# Altium schematic sheet KickerManager.SchDoc: Gestion du kicker
size A4; DocumentNumber: 1; Revision: Simon Bouchard; SheetNumber: 1; SheetTotal: 4; Version: Gamma 1.0; Conceptor: Philippe T. Simon B. Léonard G. Alexia B-L.
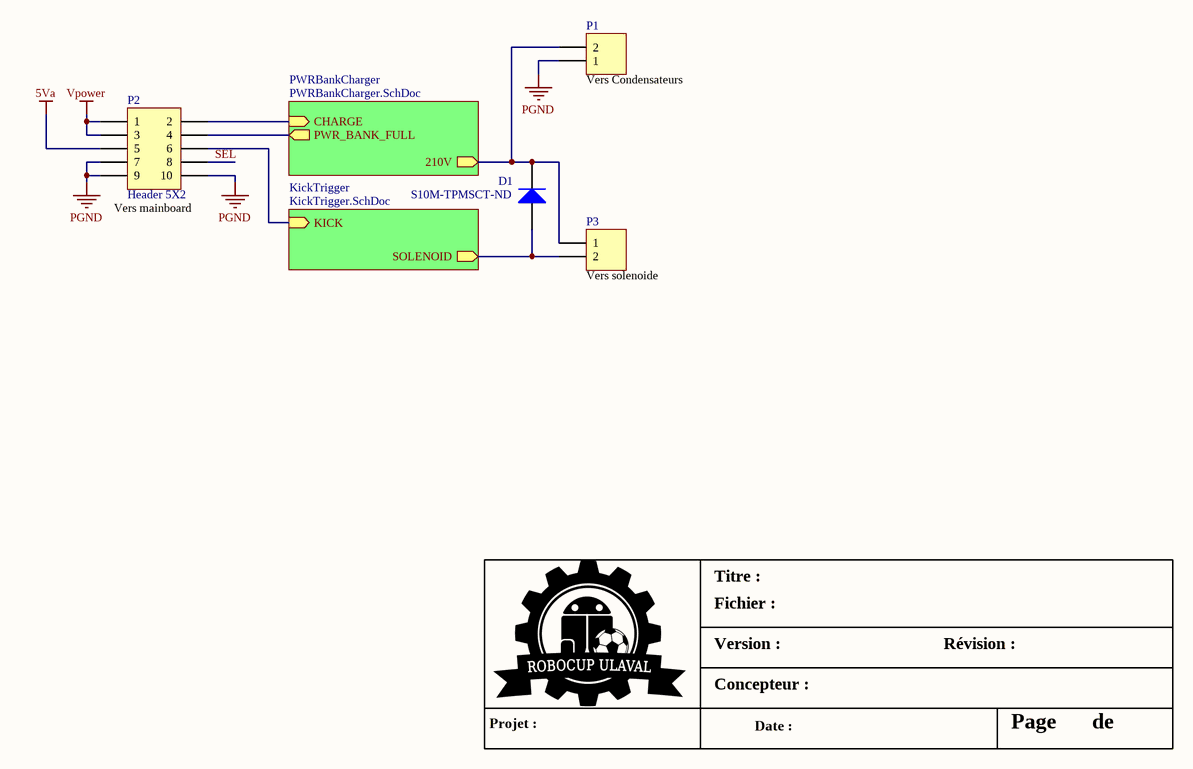
[diagram p0: KickerManager.SchDoc]

## Parts
D1  Supplier Part Number 1: S10M-TPMSCT-ND  [HSMC]  (hidden comment: S10M-TP)
P1  Header 2  [0.156mil 2pin header]  (value not drawn)
P2  Header 5X2  [HDR2X5]
P3  Header 2  [0.156mil 2pin header]  (value not drawn)

## Sub-sheets
KickTrigger = KickTrigger.SchDoc: KICK (in), SOLENOID (out)
PWRBankCharger = PWRBankCharger.SchDoc: CHARGE (in), PWR_BANK_FULL (out), 210V (out)

## Nets
5Va: P2.5
PGND: P1.1 P2.7 P2.9 P2.10
Vpower: P2.1 P2.3
SEL: P2.8
NetD1_A: D1.A P3.2 ; sheet KickTrigger/SOLENOID
NetD1_K: D1.K P1.2 P3.1 ; sheet PWRBankCharger/210V
NetP2_2: P2.2 ; sheet PWRBankCharger/CHARGE
NetP2_4: P2.4 ; sheet PWRBankCharger/PWR_BANK_FULL
NetP2_6: P2.6 ; sheet KickTrigger/KICK

## Notes on the sheet
- (near P1) Vers Condensateurs
- (near P2) Vers mainboard
- (near P3) Vers solenoide
- Titre :
- Version :
- Fichier :
- Révision :
- Projet :
- Concepteur :
- Date :
- Page
- de

## Library data of the parts
D1 = S10M-TP: DIODE GEN PURP 1KV 10A DO214AB; Manufacturer: Micro Commercial Co; Diode Type: Standard; Voltage - DC Reverse (Vr) (Max): 1000V (1kV); Voltage - Forward (Vf) (Max) @ If: 1.2V @ 10A; Speed: Standard Recovery >500ns, > 200mA (Io); Current - Reverse Leakage @ Vr: 10µA @ 1000V; Supplier 1: Digi-Key; Manufacturer Part Number: S10M-TP; RoHS: RoHS Compliant; Category: Discrete Semiconductor Products; Stock 1: 16490; Pricing 1: 1=0.96, 10=0.835, 25=0.7392, 100=0.6438, 250=0.5604, 500=0.47694 (CAD); Packaging: Cut Tape (CT); Part Status: Active; Current - Average Rectified (Io): 10A; Capacitance @ Vr, F: -; Mounting Type: Surface Mount; Package / Case: DO-214AB, SMC; Supplier Device Package: DO-214AB, (SMC); Operating Temperature - Junction: -55°C ~ 150°C; ComponentLink1URL: http://www.mccsemi.com/up_pdf/S10A~S10M(HSMC).PDF; ComponentLink1Description: http://www.mccsemi.com/up_pdf/S10A~S10M(HSMC).PDF
P1 P3 = Header 2pin 0.156: Header, 2-Pin, 0.156mil
P2 = Header 5X2: Header, 5-Pin, Dual row; LatestRevisionDate: 17-Jul-2002; LatestRevisionNote: Re-released for DXP Platform.; Publisher: Altium Limited